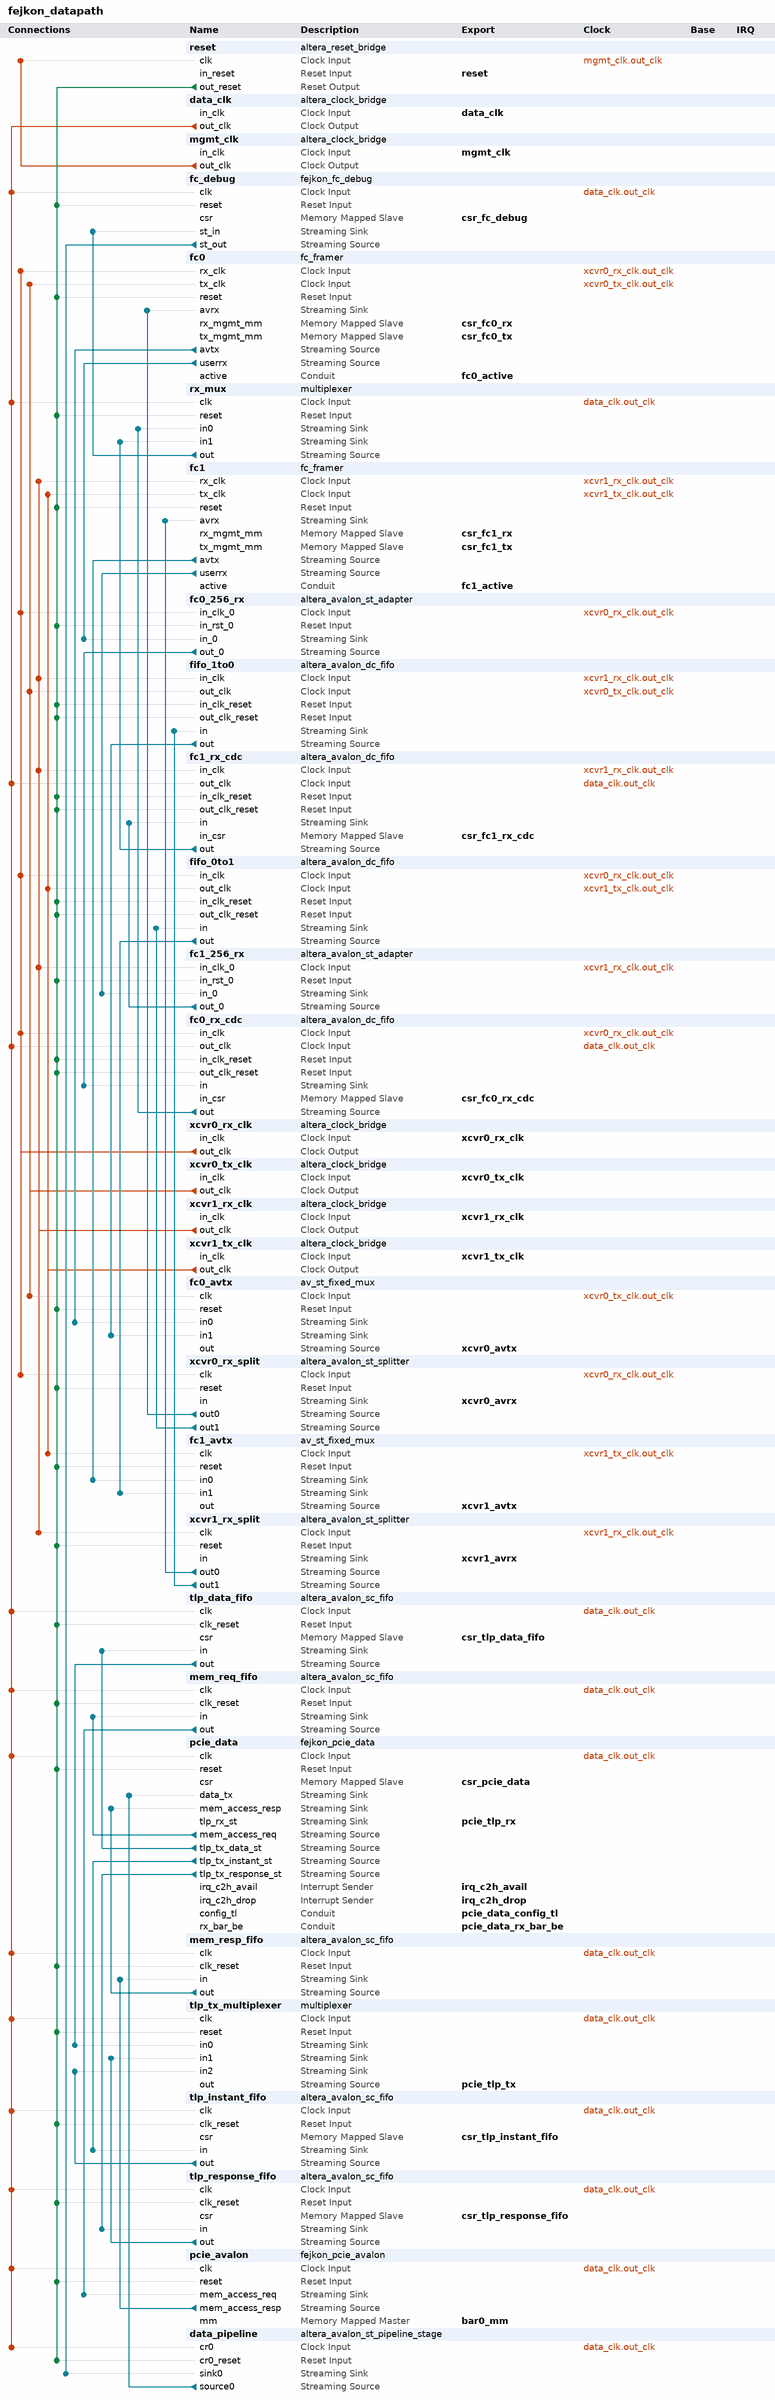
[diagram p0: system contents]
# Platform Designer (Qsys) system fejkon_datapath, Stratix V 5SGXEA7N2F45C2
# Parameters at their usual value, and those the tool derives, are not listed.
package require -exact qsys 20.1
create_system fejkon_datapath
set_project_property DEVICE_FAMILY {Stratix V}
set_project_property DEVICE 5SGXEA7N2F45C2

add_instance reset altera_reset_bridge 20.1
set_instance_parameter_value reset ACTIVE_LOW_RESET 0
set_instance_parameter_value reset SYNCHRONOUS_EDGES both

add_instance data_clk altera_clock_bridge 20.1
set_instance_parameter_value data_clk DERIVED_CLOCK_RATE 0
set_instance_parameter_value data_clk EXPLICIT_CLOCK_RATE 250000000

add_instance mgmt_clk altera_clock_bridge 20.1
set_instance_parameter_value mgmt_clk DERIVED_CLOCK_RATE 0
set_instance_parameter_value mgmt_clk EXPLICIT_CLOCK_RATE 0

add_instance fc_debug fejkon_fc_debug 1.0

add_instance fc0 fc_framer 1.0
set_instance_parameter_value fc0 MTU 3072

add_instance rx_mux multiplexer 20.1
set_instance_parameter_value rx_mux bitsPerSymbol 8
set_instance_parameter_value rx_mux errorWidth 0
set_instance_parameter_value rx_mux numInputInterfaces 4
set_instance_parameter_value rx_mux outChannelWidth 2
set_instance_parameter_value rx_mux packetScheduling true
set_instance_parameter_value rx_mux schedulingSize 2
set_instance_parameter_value rx_mux symbolsPerBeat 32
set_instance_parameter_value rx_mux useHighBitsOfChannel true
set_instance_parameter_value rx_mux usePackets true

add_instance fc1 fc_framer 1.0
set_instance_parameter_value fc1 MTU 3072

add_instance fc0_256_rx altera_avalon_st_adapter 20.1
set_instance_parameter_value fc0_256_rx inBitsPerSymbol 8
set_instance_parameter_value fc0_256_rx inChannelWidth 0
set_instance_parameter_value fc0_256_rx inDataWidth 32
set_instance_parameter_value fc0_256_rx inErrorWidth 0
set_instance_parameter_value fc0_256_rx inMaxChannel 0
set_instance_parameter_value fc0_256_rx inReadyLatency 0
set_instance_parameter_value fc0_256_rx inUseEmptyPort 1
set_instance_parameter_value fc0_256_rx inUsePackets 1
set_instance_parameter_value fc0_256_rx inUseReady 0
set_instance_parameter_value fc0_256_rx inUseValid 1
set_instance_parameter_value fc0_256_rx outChannelWidth 0
set_instance_parameter_value fc0_256_rx outDataWidth 256
set_instance_parameter_value fc0_256_rx outErrorWidth 0
set_instance_parameter_value fc0_256_rx outMaxChannel 0
set_instance_parameter_value fc0_256_rx outReadyLatency 0
set_instance_parameter_value fc0_256_rx outUseEmptyPort 1
set_instance_parameter_value fc0_256_rx outUseReady 1
set_instance_parameter_value fc0_256_rx outUseValid 1

add_instance fifo_1to0 altera_avalon_dc_fifo 20.1
set_instance_parameter_value fifo_1to0 BITS_PER_SYMBOL 9
set_instance_parameter_value fifo_1to0 FIFO_DEPTH 16
set_instance_parameter_value fifo_1to0 SYMBOLS_PER_BEAT 4
set_instance_parameter_value fifo_1to0 USE_PACKETS 0

add_instance fc1_rx_cdc altera_avalon_dc_fifo 20.1
set_instance_parameter_value fc1_rx_cdc BITS_PER_SYMBOL 8
set_instance_parameter_value fc1_rx_cdc FIFO_DEPTH 512
set_instance_parameter_value fc1_rx_cdc SYMBOLS_PER_BEAT 32
set_instance_parameter_value fc1_rx_cdc USE_IN_FILL_LEVEL 1
set_instance_parameter_value fc1_rx_cdc USE_PACKETS 1

add_instance fifo_0to1 altera_avalon_dc_fifo 20.1
set_instance_parameter_value fifo_0to1 BITS_PER_SYMBOL 9
set_instance_parameter_value fifo_0to1 FIFO_DEPTH 16
set_instance_parameter_value fifo_0to1 SYMBOLS_PER_BEAT 4
set_instance_parameter_value fifo_0to1 USE_PACKETS 0

add_instance fc1_256_rx altera_avalon_st_adapter 20.1
set_instance_parameter_value fc1_256_rx inBitsPerSymbol 8
set_instance_parameter_value fc1_256_rx inChannelWidth 0
set_instance_parameter_value fc1_256_rx inDataWidth 32
set_instance_parameter_value fc1_256_rx inErrorWidth 0
set_instance_parameter_value fc1_256_rx inMaxChannel 0
set_instance_parameter_value fc1_256_rx inReadyLatency 0
set_instance_parameter_value fc1_256_rx inUseEmptyPort 1
set_instance_parameter_value fc1_256_rx inUsePackets 1
set_instance_parameter_value fc1_256_rx inUseReady 0
set_instance_parameter_value fc1_256_rx inUseValid 1
set_instance_parameter_value fc1_256_rx outChannelWidth 0
set_instance_parameter_value fc1_256_rx outDataWidth 256
set_instance_parameter_value fc1_256_rx outErrorWidth 0
set_instance_parameter_value fc1_256_rx outMaxChannel 0
set_instance_parameter_value fc1_256_rx outReadyLatency 0
set_instance_parameter_value fc1_256_rx outUseEmptyPort 1
set_instance_parameter_value fc1_256_rx outUseReady 1
set_instance_parameter_value fc1_256_rx outUseValid 1

add_instance fc0_rx_cdc altera_avalon_dc_fifo 20.1
set_instance_parameter_value fc0_rx_cdc BITS_PER_SYMBOL 8
set_instance_parameter_value fc0_rx_cdc FIFO_DEPTH 512
set_instance_parameter_value fc0_rx_cdc SYMBOLS_PER_BEAT 32
set_instance_parameter_value fc0_rx_cdc USE_IN_FILL_LEVEL 1
set_instance_parameter_value fc0_rx_cdc USE_PACKETS 1

add_instance xcvr0_rx_clk altera_clock_bridge 20.1
set_instance_parameter_value xcvr0_rx_clk DERIVED_CLOCK_RATE 0
set_instance_parameter_value xcvr0_rx_clk EXPLICIT_CLOCK_RATE 106250000

add_instance xcvr0_tx_clk altera_clock_bridge 20.1
set_instance_parameter_value xcvr0_tx_clk DERIVED_CLOCK_RATE 0
set_instance_parameter_value xcvr0_tx_clk EXPLICIT_CLOCK_RATE 106250000

add_instance xcvr1_rx_clk altera_clock_bridge 20.1
set_instance_parameter_value xcvr1_rx_clk DERIVED_CLOCK_RATE 0
set_instance_parameter_value xcvr1_rx_clk EXPLICIT_CLOCK_RATE 106250000

add_instance xcvr1_tx_clk altera_clock_bridge 20.1
set_instance_parameter_value xcvr1_tx_clk DERIVED_CLOCK_RATE 0
set_instance_parameter_value xcvr1_tx_clk EXPLICIT_CLOCK_RATE 106250000

add_instance fc0_avtx av_st_fixed_mux 1.0
set_instance_parameter_value fc0_avtx AvChannel false
set_instance_parameter_value fc0_avtx AvError false
set_instance_parameter_value fc0_avtx AvPacket false
set_instance_parameter_value fc0_avtx BitsPerSymbol 9
set_instance_parameter_value fc0_avtx ChanWidth 1
set_instance_parameter_value fc0_avtx SelectedPort 0
set_instance_parameter_value fc0_avtx SymbolsPerBeat 4

add_instance xcvr0_rx_split altera_avalon_st_splitter 20.1
set_instance_parameter_value xcvr0_rx_split BITS_PER_SYMBOL 9
set_instance_parameter_value xcvr0_rx_split CHANNEL_WIDTH 1
set_instance_parameter_value xcvr0_rx_split DATA_WIDTH 36
set_instance_parameter_value xcvr0_rx_split ERROR_WIDTH 1
set_instance_parameter_value xcvr0_rx_split MAX_CHANNELS 1
set_instance_parameter_value xcvr0_rx_split NUMBER_OF_OUTPUTS 2
set_instance_parameter_value xcvr0_rx_split QUALIFY_VALID_OUT 1
set_instance_parameter_value xcvr0_rx_split READY_LATENCY 0
set_instance_parameter_value xcvr0_rx_split USE_CHANNEL 0
set_instance_parameter_value xcvr0_rx_split USE_DATA 1
set_instance_parameter_value xcvr0_rx_split USE_ERROR 0
set_instance_parameter_value xcvr0_rx_split USE_PACKETS 0
set_instance_parameter_value xcvr0_rx_split USE_READY 0
set_instance_parameter_value xcvr0_rx_split USE_VALID 1

add_instance fc1_avtx av_st_fixed_mux 1.0
set_instance_parameter_value fc1_avtx AvChannel false
set_instance_parameter_value fc1_avtx AvError false
set_instance_parameter_value fc1_avtx AvPacket false
set_instance_parameter_value fc1_avtx BitsPerSymbol 9
set_instance_parameter_value fc1_avtx ChanWidth 1
set_instance_parameter_value fc1_avtx SelectedPort 0
set_instance_parameter_value fc1_avtx SymbolsPerBeat 4

add_instance xcvr1_rx_split altera_avalon_st_splitter 20.1
set_instance_parameter_value xcvr1_rx_split BITS_PER_SYMBOL 9
set_instance_parameter_value xcvr1_rx_split CHANNEL_WIDTH 1
set_instance_parameter_value xcvr1_rx_split DATA_WIDTH 36
set_instance_parameter_value xcvr1_rx_split ERROR_WIDTH 1
set_instance_parameter_value xcvr1_rx_split MAX_CHANNELS 1
set_instance_parameter_value xcvr1_rx_split NUMBER_OF_OUTPUTS 2
set_instance_parameter_value xcvr1_rx_split QUALIFY_VALID_OUT 1
set_instance_parameter_value xcvr1_rx_split READY_LATENCY 0
set_instance_parameter_value xcvr1_rx_split USE_CHANNEL 0
set_instance_parameter_value xcvr1_rx_split USE_DATA 1
set_instance_parameter_value xcvr1_rx_split USE_ERROR 0
set_instance_parameter_value xcvr1_rx_split USE_PACKETS 0
set_instance_parameter_value xcvr1_rx_split USE_READY 0
set_instance_parameter_value xcvr1_rx_split USE_VALID 1

add_instance tlp_data_fifo altera_avalon_sc_fifo 20.1
set_instance_parameter_value tlp_data_fifo BITS_PER_SYMBOL 8
set_instance_parameter_value tlp_data_fifo CHANNEL_WIDTH 0
set_instance_parameter_value tlp_data_fifo ERROR_WIDTH 0
set_instance_parameter_value tlp_data_fifo FIFO_DEPTH 1024
set_instance_parameter_value tlp_data_fifo SYMBOLS_PER_BEAT 32
set_instance_parameter_value tlp_data_fifo USE_FILL_LEVEL 1
set_instance_parameter_value tlp_data_fifo USE_MEMORY_BLOCKS 1
set_instance_parameter_value tlp_data_fifo USE_PACKETS 1
set_instance_parameter_value tlp_data_fifo USE_STORE_FORWARD 0

add_instance mem_req_fifo altera_avalon_sc_fifo 20.1
set_instance_parameter_value mem_req_fifo BITS_PER_SYMBOL 128
set_instance_parameter_value mem_req_fifo CHANNEL_WIDTH 0
set_instance_parameter_value mem_req_fifo ERROR_WIDTH 0
set_instance_parameter_value mem_req_fifo FIFO_DEPTH 64
set_instance_parameter_value mem_req_fifo USE_FILL_LEVEL 0
set_instance_parameter_value mem_req_fifo USE_MEMORY_BLOCKS 1
set_instance_parameter_value mem_req_fifo USE_STORE_FORWARD 0

add_instance pcie_data fejkon_pcie_data 1.0

add_instance mem_resp_fifo altera_avalon_sc_fifo 20.1
set_instance_parameter_value mem_resp_fifo BITS_PER_SYMBOL 128
set_instance_parameter_value mem_resp_fifo CHANNEL_WIDTH 0
set_instance_parameter_value mem_resp_fifo ERROR_WIDTH 0
set_instance_parameter_value mem_resp_fifo FIFO_DEPTH 64
set_instance_parameter_value mem_resp_fifo USE_FILL_LEVEL 0
set_instance_parameter_value mem_resp_fifo USE_MEMORY_BLOCKS 1
set_instance_parameter_value mem_resp_fifo USE_STORE_FORWARD 0

add_instance tlp_tx_multiplexer multiplexer 20.1
set_instance_parameter_value tlp_tx_multiplexer bitsPerSymbol 8
set_instance_parameter_value tlp_tx_multiplexer errorWidth 0
set_instance_parameter_value tlp_tx_multiplexer numInputInterfaces 3
set_instance_parameter_value tlp_tx_multiplexer outChannelWidth 2
set_instance_parameter_value tlp_tx_multiplexer packetScheduling true
set_instance_parameter_value tlp_tx_multiplexer schedulingSize 2
set_instance_parameter_value tlp_tx_multiplexer symbolsPerBeat 32
set_instance_parameter_value tlp_tx_multiplexer useHighBitsOfChannel true
set_instance_parameter_value tlp_tx_multiplexer usePackets true

add_instance tlp_instant_fifo altera_avalon_sc_fifo 20.1
set_instance_parameter_value tlp_instant_fifo BITS_PER_SYMBOL 8
set_instance_parameter_value tlp_instant_fifo CHANNEL_WIDTH 0
set_instance_parameter_value tlp_instant_fifo ERROR_WIDTH 0
set_instance_parameter_value tlp_instant_fifo FIFO_DEPTH 1024
set_instance_parameter_value tlp_instant_fifo SYMBOLS_PER_BEAT 32
set_instance_parameter_value tlp_instant_fifo USE_FILL_LEVEL 1
set_instance_parameter_value tlp_instant_fifo USE_MEMORY_BLOCKS 1
set_instance_parameter_value tlp_instant_fifo USE_PACKETS 1
set_instance_parameter_value tlp_instant_fifo USE_STORE_FORWARD 0

add_instance tlp_response_fifo altera_avalon_sc_fifo 20.1
set_instance_parameter_value tlp_response_fifo BITS_PER_SYMBOL 8
set_instance_parameter_value tlp_response_fifo CHANNEL_WIDTH 0
set_instance_parameter_value tlp_response_fifo ERROR_WIDTH 0
set_instance_parameter_value tlp_response_fifo FIFO_DEPTH 1024
set_instance_parameter_value tlp_response_fifo SYMBOLS_PER_BEAT 32
set_instance_parameter_value tlp_response_fifo USE_FILL_LEVEL 1
set_instance_parameter_value tlp_response_fifo USE_MEMORY_BLOCKS 1
set_instance_parameter_value tlp_response_fifo USE_PACKETS 1
set_instance_parameter_value tlp_response_fifo USE_STORE_FORWARD 0

add_instance pcie_avalon fejkon_pcie_avalon 1.0

add_instance data_pipeline altera_avalon_st_pipeline_stage 20.1
set_instance_parameter_value data_pipeline BITS_PER_SYMBOL 8
set_instance_parameter_value data_pipeline CHANNEL_WIDTH 2
set_instance_parameter_value data_pipeline ERROR_WIDTH 0
set_instance_parameter_value data_pipeline MAX_CHANNEL 0
set_instance_parameter_value data_pipeline PIPELINE_READY 1
set_instance_parameter_value data_pipeline SYMBOLS_PER_BEAT 32
set_instance_parameter_value data_pipeline USE_EMPTY 1
set_instance_parameter_value data_pipeline USE_PACKETS 1

# connections
add_connection data_clk.out_clk data_pipeline.cr0 clock
add_connection data_clk.out_clk fc0_rx_cdc.out_clk clock
add_connection data_clk.out_clk fc1_rx_cdc.out_clk clock
add_connection data_clk.out_clk fc_debug.clk clock
add_connection data_clk.out_clk mem_req_fifo.clk clock
add_connection data_clk.out_clk mem_resp_fifo.clk clock
add_connection data_clk.out_clk pcie_avalon.clk clock
add_connection data_clk.out_clk pcie_data.clk clock
add_connection data_clk.out_clk rx_mux.clk clock
add_connection data_clk.out_clk tlp_data_fifo.clk clock
add_connection data_clk.out_clk tlp_instant_fifo.clk clock
add_connection data_clk.out_clk tlp_response_fifo.clk clock
add_connection data_clk.out_clk tlp_tx_multiplexer.clk clock
add_connection mgmt_clk.out_clk reset.clk clock
add_connection xcvr0_rx_clk.out_clk fc0.rx_clk clock
add_connection xcvr0_rx_clk.out_clk fc0_256_rx.in_clk_0 clock
add_connection xcvr0_rx_clk.out_clk fc0_rx_cdc.in_clk clock
add_connection xcvr0_rx_clk.out_clk fifo_0to1.in_clk clock
add_connection xcvr0_rx_clk.out_clk xcvr0_rx_split.clk clock
add_connection xcvr0_tx_clk.out_clk fc0.tx_clk clock
add_connection xcvr0_tx_clk.out_clk fc0_avtx.clk clock
add_connection xcvr0_tx_clk.out_clk fifo_1to0.out_clk clock
add_connection xcvr1_rx_clk.out_clk fc1.rx_clk clock
add_connection xcvr1_rx_clk.out_clk fc1_256_rx.in_clk_0 clock
add_connection xcvr1_rx_clk.out_clk fc1_rx_cdc.in_clk clock
add_connection xcvr1_rx_clk.out_clk fifo_1to0.in_clk clock
add_connection xcvr1_rx_clk.out_clk xcvr1_rx_split.clk clock
add_connection xcvr1_tx_clk.out_clk fc1.tx_clk clock
add_connection xcvr1_tx_clk.out_clk fc1_avtx.clk clock
add_connection xcvr1_tx_clk.out_clk fifo_0to1.out_clk clock
add_connection reset.out_reset data_pipeline.cr0_reset reset
add_connection reset.out_reset fc0.reset reset
add_connection reset.out_reset fc0_256_rx.in_rst_0 reset
add_connection reset.out_reset fc0_avtx.reset reset
add_connection reset.out_reset fc0_rx_cdc.in_clk_reset reset
add_connection reset.out_reset fc0_rx_cdc.out_clk_reset reset
add_connection reset.out_reset fc1.reset reset
add_connection reset.out_reset fc1_256_rx.in_rst_0 reset
add_connection reset.out_reset fc1_avtx.reset reset
add_connection reset.out_reset fc1_rx_cdc.in_clk_reset reset
add_connection reset.out_reset fc1_rx_cdc.out_clk_reset reset
add_connection reset.out_reset fc_debug.reset reset
add_connection reset.out_reset fifo_0to1.in_clk_reset reset
add_connection reset.out_reset fifo_0to1.out_clk_reset reset
add_connection reset.out_reset fifo_1to0.in_clk_reset reset
add_connection reset.out_reset fifo_1to0.out_clk_reset reset
add_connection reset.out_reset mem_req_fifo.clk_reset reset
add_connection reset.out_reset mem_resp_fifo.clk_reset reset
add_connection reset.out_reset pcie_avalon.reset reset
add_connection reset.out_reset pcie_data.reset reset
add_connection reset.out_reset rx_mux.reset reset
add_connection reset.out_reset tlp_data_fifo.clk_reset reset
add_connection reset.out_reset tlp_instant_fifo.clk_reset reset
add_connection reset.out_reset tlp_response_fifo.clk_reset reset
add_connection reset.out_reset tlp_tx_multiplexer.reset reset
add_connection reset.out_reset xcvr0_rx_split.reset reset
add_connection reset.out_reset xcvr1_rx_split.reset reset
add_connection data_pipeline.source0 pcie_data.data_tx avalon_streaming
add_connection fc0.avtx fc0_avtx.in0 avalon_streaming
add_connection fc0.userrx fc0_256_rx.in_0 avalon_streaming
add_connection fc0_256_rx.out_0 fc0_rx_cdc.in avalon_streaming
add_connection fc0_rx_cdc.out rx_mux.in0 avalon_streaming
add_connection fc1.avtx fc1_avtx.in0 avalon_streaming
add_connection fc1.userrx fc1_256_rx.in_0 avalon_streaming
add_connection fc1_256_rx.out_0 fc1_rx_cdc.in avalon_streaming
add_connection fc1_rx_cdc.out rx_mux.in1 avalon_streaming
add_connection fc_debug.st_out data_pipeline.sink0 avalon_streaming
add_connection fifo_0to1.out fc1_avtx.in1 avalon_streaming
add_connection fifo_1to0.out fc0_avtx.in1 avalon_streaming
add_connection mem_req_fifo.out pcie_avalon.mem_access_req avalon_streaming
add_connection mem_resp_fifo.out pcie_data.mem_access_resp avalon_streaming
add_connection pcie_avalon.mem_access_resp mem_resp_fifo.in avalon_streaming
add_connection pcie_data.mem_access_req mem_req_fifo.in avalon_streaming
add_connection pcie_data.tlp_tx_data_st tlp_data_fifo.in avalon_streaming
add_connection pcie_data.tlp_tx_instant_st tlp_instant_fifo.in avalon_streaming
add_connection pcie_data.tlp_tx_response_st tlp_response_fifo.in avalon_streaming
add_connection rx_mux.out fc_debug.st_in avalon_streaming
add_connection tlp_data_fifo.out tlp_tx_multiplexer.in0 avalon_streaming
add_connection tlp_instant_fifo.out tlp_tx_multiplexer.in2 avalon_streaming
add_connection tlp_response_fifo.out tlp_tx_multiplexer.in1 avalon_streaming
add_connection xcvr0_rx_split.out0 fc0.avrx avalon_streaming
add_connection xcvr0_rx_split.out1 fifo_0to1.in avalon_streaming
add_connection xcvr1_rx_split.out0 fc1.avrx avalon_streaming
add_connection xcvr1_rx_split.out1 fifo_1to0.in avalon_streaming

# exported interfaces
add_interface bar0_mm avalon master
set_interface_property bar0_mm EXPORT_OF pcie_avalon.mm
add_interface csr_fc0_rx avalon slave
set_interface_property csr_fc0_rx EXPORT_OF fc0.rx_mgmt_mm
add_interface csr_fc0_rx_cdc avalon slave
set_interface_property csr_fc0_rx_cdc EXPORT_OF fc0_rx_cdc.in_csr
add_interface csr_fc0_tx avalon slave
set_interface_property csr_fc0_tx EXPORT_OF fc0.tx_mgmt_mm
add_interface csr_fc1_rx avalon slave
set_interface_property csr_fc1_rx EXPORT_OF fc1.rx_mgmt_mm
add_interface csr_fc1_rx_cdc avalon slave
set_interface_property csr_fc1_rx_cdc EXPORT_OF fc1_rx_cdc.in_csr
add_interface csr_fc1_tx avalon slave
set_interface_property csr_fc1_tx EXPORT_OF fc1.tx_mgmt_mm
add_interface csr_fc_debug avalon slave
set_interface_property csr_fc_debug EXPORT_OF fc_debug.csr
add_interface csr_pcie_data avalon slave
set_interface_property csr_pcie_data EXPORT_OF pcie_data.csr
add_interface csr_tlp_data_fifo avalon slave
set_interface_property csr_tlp_data_fifo EXPORT_OF tlp_data_fifo.csr
add_interface csr_tlp_instant_fifo avalon slave
set_interface_property csr_tlp_instant_fifo EXPORT_OF tlp_instant_fifo.csr
add_interface csr_tlp_response_fifo avalon slave
set_interface_property csr_tlp_response_fifo EXPORT_OF tlp_response_fifo.csr
add_interface data_clk clock sink
set_interface_property data_clk EXPORT_OF data_clk.in_clk
add_interface fc0_active conduit end
set_interface_property fc0_active EXPORT_OF fc0.active
add_interface fc1_active conduit end
set_interface_property fc1_active EXPORT_OF fc1.active
add_interface irq_c2h_avail interrupt sender
set_interface_property irq_c2h_avail EXPORT_OF pcie_data.irq_c2h_avail
add_interface irq_c2h_drop interrupt sender
set_interface_property irq_c2h_drop EXPORT_OF pcie_data.irq_c2h_drop
add_interface mgmt_clk clock sink
set_interface_property mgmt_clk EXPORT_OF mgmt_clk.in_clk
add_interface pcie_data_config_tl conduit end
set_interface_property pcie_data_config_tl EXPORT_OF pcie_data.config_tl
add_interface pcie_data_rx_bar_be conduit end
set_interface_property pcie_data_rx_bar_be EXPORT_OF pcie_data.rx_bar_be
add_interface pcie_tlp_rx avalon_streaming sink
set_interface_property pcie_tlp_rx EXPORT_OF pcie_data.tlp_rx_st
add_interface pcie_tlp_tx avalon_streaming source
set_interface_property pcie_tlp_tx EXPORT_OF tlp_tx_multiplexer.out
add_interface reset reset sink
set_interface_property reset EXPORT_OF reset.in_reset
add_interface xcvr0_avrx avalon_streaming sink
set_interface_property xcvr0_avrx EXPORT_OF xcvr0_rx_split.in
add_interface xcvr0_avtx avalon_streaming source
set_interface_property xcvr0_avtx EXPORT_OF fc0_avtx.out
add_interface xcvr0_rx_clk clock sink
set_interface_property xcvr0_rx_clk EXPORT_OF xcvr0_rx_clk.in_clk
add_interface xcvr0_tx_clk clock sink
set_interface_property xcvr0_tx_clk EXPORT_OF xcvr0_tx_clk.in_clk
add_interface xcvr1_avrx avalon_streaming sink
set_interface_property xcvr1_avrx EXPORT_OF xcvr1_rx_split.in
add_interface xcvr1_avtx avalon_streaming source
set_interface_property xcvr1_avtx EXPORT_OF fc1_avtx.out
add_interface xcvr1_rx_clk clock sink
set_interface_property xcvr1_rx_clk EXPORT_OF xcvr1_rx_clk.in_clk
add_interface xcvr1_tx_clk clock sink
set_interface_property xcvr1_tx_clk EXPORT_OF xcvr1_tx_clk.in_clk

set_interconnect_requirement {$system} qsys_mm.clockCrossingAdapter HANDSHAKE
set_interconnect_requirement {$system} qsys_mm.enableEccProtection FALSE
set_interconnect_requirement {$system} qsys_mm.insertDefaultSlave FALSE
set_interconnect_requirement {$system} qsys_mm.maxAdditionalLatency 1

save_system fejkon_datapath.qsys
